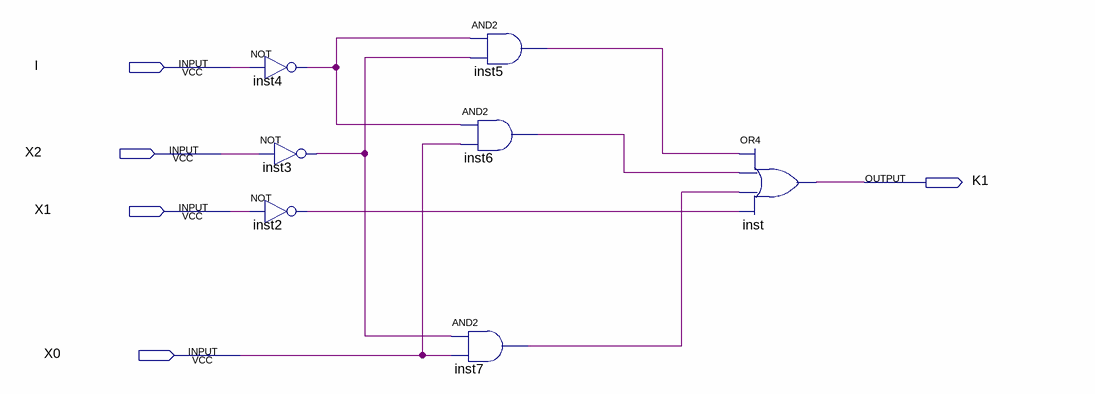
[diagram p0: schematic sheet]
// Quartus schematic K1.bdf as structural Verilog: 7 symbols, 5 pins
module K1 (
  input  I,
  input  X2,
  input  X1,
  input  X0,
  output K1
);

  wire inst2_out, inst3_out, inst4_out, inst5_out, inst6_out, inst7_out;

  not inst4 (inst4_out, I);
  not inst3 (inst3_out, X2);
  not inst2 (inst2_out, X1);
  and inst6 (inst6_out, inst4_out, X0);
  and inst7 (inst7_out, inst3_out, X0);
  and inst5 (inst5_out, inst4_out, inst3_out);
  or inst (K1, inst5_out, inst6_out, inst7_out, inst2_out);
endmodule
